# EAGLE schematic untitled (EAGLE 6.1)
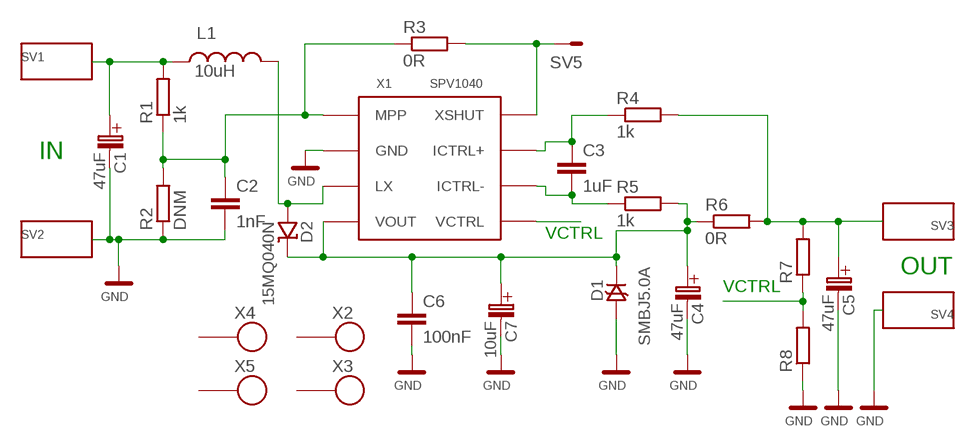
[diagram p0: schematic, sheet 1]

## Parts
C1  47uF  C  [C]
C2  1nF  C0805  [C0805]
C3  1uF  C0805  [C0805]
C4  47uF  C  [C]
C5  47uF  C  [C]
C6  100nF  C0805  [C0805]
C7  10uF  B  [B]
D1  SMBJ5.0A  D-TRANSIL  [SMB]
D2  15MQ040N  D-SHOTKY-SMA  [SMA]
L1  10uH  DE1205-10  [DE1205-10]
R1  1k  R0805  [0805]
R2  DNM  R0805  [0805]
R3  0R  R1206  [1206]
R4  1k  R0805  [0805]
R5  1k  R0805  [0805]
R6  0R  R1206  [1206]
R7  R0805  [0805]
R8  R0805  [0805]
SV1  WAGO256  [WAGO256]
SV2  WAGO256  [WAGO256]
SV3  WAGO256  [WAGO256]
SV4  WAGO256  [WAGO256]
SV5  MA01-1  [MA01-1]
X1  SPV1040  [TSSOP8]
X2  SROUB3M  [SROUB3M]
X3  SROUB3M  [SROUB3M]
X4  SROUB3M  [SROUB3M]
X5  SROUB3M  [SROUB3M]

## Nets
GND: C1.-(C_EL-) C2.2 C4.-(C_EL-) C5.-(C_EL-) C6.2 C7.-(C_EL-) D1.A R2.1 R8.1 SV2.1 SV2.A1 SV4.1 SV4.A1 X1.2(GND)
N$1: C1.+(C_EL+) L1.P$1 R1.2 SV1.1 SV1.A1
N$2: R3.2 SV5.1 X1.8(XSHUT)
N$3: C2.1 R1.1 R2.2 R3.1 X1.1(MPP)
N$4: C3.1 R4.1 X1.7(ICTRL+)
N$5: C4.+(C_EL+) C6.1 C7.+(C_EL+) D1.K D2.K R5.2 R6.1 X1.4(VOUT)
N$6: D2.A L1.P$2 X1.3(LX)
N$8: C5.+(C_EL+) R4.2 R6.2 R7.2 SV3.1 SV3.A1
N$9: C3.2 R5.1 X1.6(ICTRL-)
VCTRL: R7.1 R8.2 X1.5(VCTRL)
Unconnected: X2.P$1 X3.P$1 X4.P$1 X5.P$1

## Notes on the sheet
- IN
- VCTRL
- OUT
- VCTRL

## Library data of the parts
C1 C4 C5 = moje_C:C
C2 C3 C6 = moje_C:C0805
C7 = moje_C:B
D1 = moje_diody:D-TRANSIL: Trnasil SMB
D2 = moje_diody:D-SHOTKY-SMA
L1 = moje_L:DE1205-10: tlumivka
R1 R2 R4 R5 R7 R8 = moje_R:R0805
R3 R6 = moje_R:R1206
SV1-SV4 = moje_konektory:WAGO256: WAGO256
SV5 = moje_hrebinky:MA01-1
X1 = moje_io:SPV1040: SPV1040
X2-X5 = moje:SROUB3M